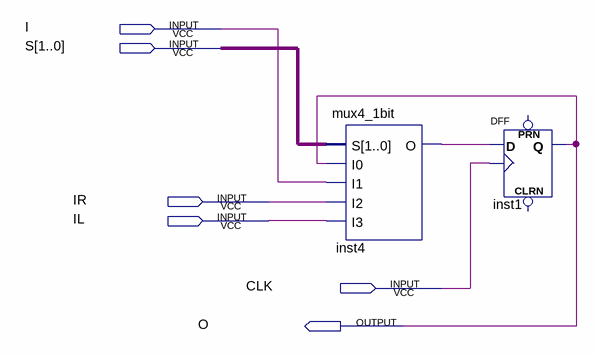
[diagram p0: schematic sheet]
// Quartus schematic SRwPL1bit.bdf as structural Verilog: 2 symbols, 6 pins
module SRwPL1bit (
  input  I,
  input  [1:0] S,
  input  IR,
  input  IL,
  input  CLK,
  output O
);

  wire inst4_o;

  mux4_1bit inst4 (.S(S), .I0(O), .I1(I), .I2(IR), .I3(IL), .O(inst4_o));
  DFF inst1 (.CLK(CLK), .D(inst4_o), .Q(O));  // open: CLRN, PRN
endmodule
